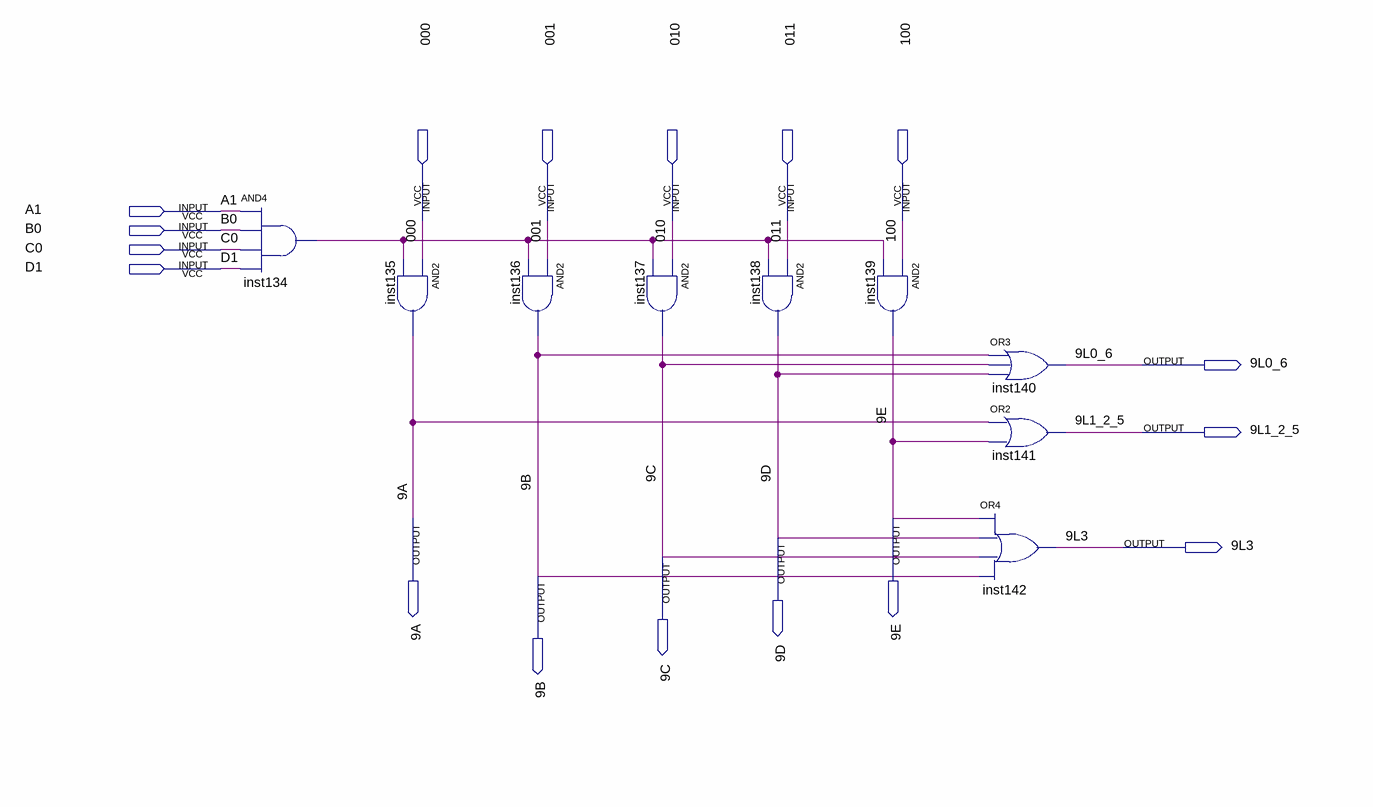
[diagram p0: schematic sheet]
// Quartus schematic carac9.bdf as structural Verilog: 9 symbols, 17 pins
module carac9 (
  input  A1,
  input  \000 ,
  input  \001 ,
  input  \010 ,
  input  \011 ,
  input  \100 ,
  input  B0,
  input  C0,
  input  D1,
  output \9L0_6 ,
  output \9L1_2_5 ,
  output \9A ,
  output \9E ,
  output \9D ,
  output \9L3 ,
  output \9C ,
  output \9B 
);

  wire inst134_out;

  and inst134 (inst134_out, A1, B0, C0, D1);
  and inst135 (\9A , \000 , inst134_out);
  and inst136 (\9B , \001 , inst134_out);
  and inst137 (\9C , \010 , inst134_out);
  and inst138 (\9D , \011 , inst134_out);
  and inst139 (\9E , \100 , inst134_out);
  or inst140 (\9L0_6 , \9B , \9C , \9D );
  or inst141 (\9L1_2_5 , \9A , \9E );
  or inst142 (\9L3 , \9E , \9D , \9C , \9B );
endmodule
